# EAGLE schematic VCA-LM13600-Dual (EAGLE 7.2.0)
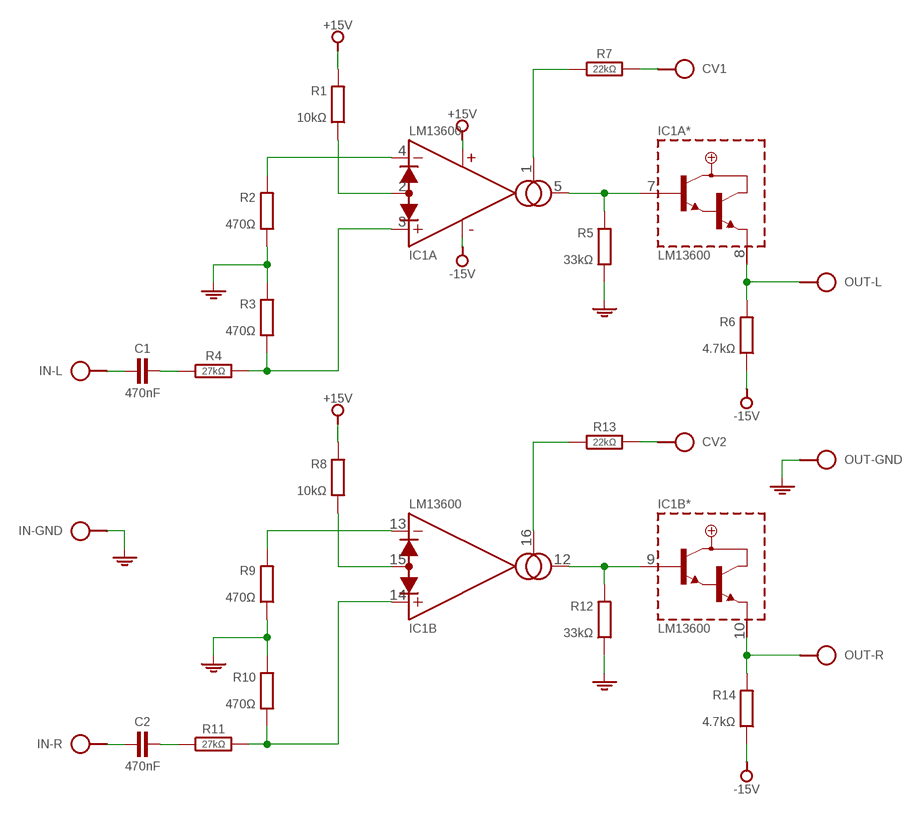
[diagram p0: schematic, sheet 1]

## Parts
C1  470nF  C-H075-020X044  [C075-020X044]
C2  470nF  C-H075-020X044  [C075-020X044]
CV1  HPORT  [SPAD]
CV2  HPORT  [SPAD]
IC1  LM13600  [DIL16]
IN  SAUDIOL-GND-R  [SPAD-L-GND-R]
OUT  SAUDIOL-GND-R  [SPAD-L-GND-R]
R1  10kΩ  R0204/10-V  [0204/10-V]
R2  470Ω  R0204/10-V  [0204/10-V]
R3  470Ω  R0204/10-V  [0204/10-V]
R4  27kΩ  R-H0204/10  [0204/10]
R5  33kΩ  R0204/10-V  [0204/10-V]
R6  4.7kΩ  R0204/10-V  [0204/10-V]
R7  22kΩ  R-H0204/10  [0204/10]
R8  10kΩ  R0204/10-V  [0204/10-V]
R9  470Ω  R0204/10-V  [0204/10-V]
R10  470Ω  R0204/10-V  [0204/10-V]
R11  27kΩ  R-H0204/10  [0204/10]
R12  33kΩ  R0204/10-V  [0204/10-V]
R13  22kΩ  R-H0204/10  [0204/10]
R14  4.7kΩ  R0204/10-V  [0204/10-V]

## Nets
+15V: R1.1 R8.1
-15V: IC1.6(5:V-) R6.2 R14.2
GND: IN.0 OUT.0 R2.2 R3.1 R5.2 R9.2 R10.1 R12.2
N$1: IC1.4(A:-IN) R2.1
N$2: C1.2 R4.1
N$3: IC1.3(A:+IN) R3.2 R4.2
N$4: IC1.2(A:DIODE/BIAS) R1.2
N$5: IC1.1(A:AMP/BIAS) R7.1
N$6: IC1.5(A:OUT) IC1.7(A*:BUFF/IN) R5.1
N$7: IC1.8(A*:BUFF/OUT) OUT.L R6.1
N$8: IC1.13(B:-IN) R9.1
N$9: IC1.14(B:+IN) R10.2 R11.2
N$10: IC1.15(B:DIODE/BIAS) R8.2
N$11: C2.2 R11.1
N$12: IC1.16(B:AMP/BIAS) R13.1
N$13: IC1.9(B*:BUFF/IN) IC1.12(B:OUT) R12.1
N$14: IC1.10(B*:BUFF/OUT) OUT.R R14.1
N$15: C1.1 IN.L
N$16: C2.1 IN.R
N$17: CV1.1 R7.2
N$18: CV2.1 R13.2

## Power pins joined to a net without a drawn wire
V+: IC1.11(5:V+)

## Library data of the parts
C1 C2 = c:C-H
CV1 CV2 = pad:HPORT
IC1 = ic:LM13600
IN OUT = pad:SAUDIO
R1-R3 R5 R6 R8-R10 R12 R14 = r:R: RESISTOR, European symbol
R4 R7 R11 R13 = r:R-H